# Altium schematic sheet ble.SchDoc
size A4
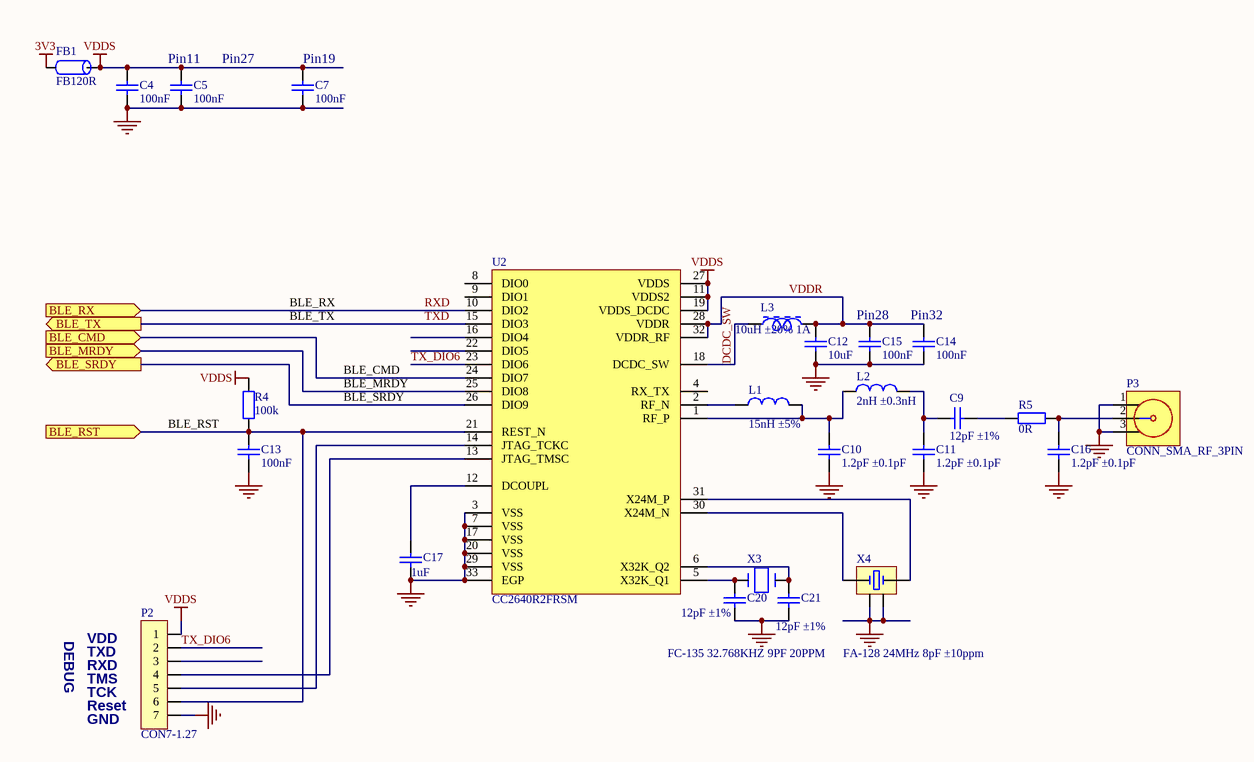
[diagram p0: ble.SchDoc]

## Parts
C4  100nF  [0402_C]
C5  100nF  [0402_C]
C7  100nF  [0402_C]
C9  12pF ±1%  [0402_C]
C10  1.2pF ±0.1pF  [0402_C]
C11  1.2pF ±0.1pF  [0402_C]
C12  10uF  [C0603]
C13  100nF  [0402_C]
C14  100nF  [0402_C]
C15  100nF  [0402_C]
C16  1.2pF ±0.1pF  [0402_C]
C17  1uF  [0402_C]
C20  12pF ±1%  [0402_C]
C21  12pF ±1%  [0402_C]
FB1  FB120R  [L0603]
L1  15nH ±5%  [LC-0402_L]
L2  2nH ±0.3nH  [LC-0402_L]
L3  10uH ±20% 1A  [L0805]
P2  CON7-1.27  [PH_7PIN_1.25_H-2]
P3  CONN_SMA_RF_3PIN  [PH_RF_2.5X2.5]
R4  100k  [0402_R]
R5  0R  [0402_R]
U2  CC2640R2FRSM  [VQFN-32_4x4x04P]
X3  FC-135 32.768KHZ 9PF 20PPM  [FC-135]
X4  FA-128 24MHz 8pF ±10ppm  [FA-128]

## Ports
BLE_CMD (in), BLE_MRDY (in), BLE_RST (in), BLE_RX (in), BLE_SRDY (out), BLE_TX (out)

## Nets
3V3: FB1.2
GND: C4.2 C5.2 C7.2 C10.1 C11.1 C12.1 C13.2 C14.2 C15.2 C16.1 C17.2 C20.1 C21.1 P2.7 P3.1 P3.3 U2.3(VSS) U2.7(VSS) U2.17(VSS) U2.20(VSS) U2.29(VSS) U2.33(EGP) X4.2 X4.4
VDDS: C4.1 C5.1 C7.1 FB1.1 P2.1 R4.2 U2.11(VDDS2) U2.19(VDDS_DCDC) U2.27(VDDS)
BLE_CMD: U2.24(DIO7) ; port BLE_CMD
BLE_MRDY: U2.25(DIO8) ; port BLE_MRDY
BLE_RST: C13.1 P2.6 R4.1 U2.21(REST_N) ; port BLE_RST
BLE_RX: U2.10(DIO2) ; port BLE_RX  [also labelled RXD]
BLE_SRDY: U2.26(DIO9) ; port BLE_SRDY
BLE_TX: U2.15(DIO3) ; port BLE_TX  [also labelled TXD]
DCDC_SW: L3.2 U2.18(DCDC_SW)
TX_DIO6: P2.2 U2.23(DIO6)
VDDR: C12.2 C14.1 C15.1 L3.1 U2.28(VDDR) U2.32(VDDR_RF)
NetC9_1: C9.1 R5.2
NetC9_2: C9.2 C11.2 L2.1
NetC10_2: C10.2 L1.1 L2.2 U2.1(RF_P)
NetC16_2: C16.2 P3.2 R5.1
NetC17_1: C17.1 U2.12(DCOUPL)
NetC20_2: C20.2 U2.5(X32K_Q1) X3.2
NetC21_2: C21.2 U2.6(X32K_Q2) X3.1
NetL1_2: L1.2 U2.2(RF_N)
NetP2_4: P2.4 U2.13(JTAG_TMSC)
NetP2_5: P2.5 U2.14(JTAG_TCKC)
NetU2_30: U2.30(X24M_N) X4.1
NetU2_31: U2.31(X24M_P) X4.3

Not connected (* = marked no-connect by the designer): P2 3; U2 4(RX_TX) 8(DIO0) 9(DIO1) 16(DIO4) 22(DIO5)

## Notes on the sheet
- (near C5) Pin11
- Pin27
- (near C7) Pin19
- (near C15) Pin28
- (near C14) Pin32
- (near P3) SMA
- DEBUG
- TMS
- TCK
- VDD
- TXD
- RXD
- GND
- (near P2) Reset

## Library data of the parts
C4 C5 C7 C13-C15 = Cap-0402_100n: 表贴电容0402,±10%,16V,X7R; Part Number: RP02.04.000221; LatestRevisionDate: 09-Feb-2017; LatestRevisionNote: SCHlib build; Publisher: ChenYinaho; PackageDescription: 0402C; Manufacturer: *; Manufacturer Part Number: *; Value: 100nF
C9 C20 C21 = Cap-0402_12p_mu_1%: 表贴陶瓷电容,0402,±1%,50V,C0G; Manufacturer: 村田; Manufacturer Part Number: GRM1555C1H120FA01D; Part Number: NEW; LatestRevisionDate: 09-Feb-2017; LatestRevisionNote: SCHlib build; Publisher: ChenYinaho; PackageDescription: C0402; Value: 12pF ±1%
C10 C11 C16 = Cap-0402_1.2p_mu: 表贴陶瓷电容,0402,±0.1pF,50V,C0G; Manufacturer: 村田; Manufacturer Part Number: GRM1555C1H1R2BA01D; Part Number: NEW; LatestRevisionDate: 09-Feb-2017; LatestRevisionNote: SCHlib build; Publisher: ChenYinaho; PackageDescription: C0402; Value: 1.2pF ±0.1pF
C12 = Cap-SMT-0603_10u: 表贴陶瓷电容,0603,±10%,10V; Manufacturer: YAGO; Part Number: RP02.04.000062; LatestRevisionDate: 09-Feb-2017; LatestRevisionNote: SCHlib build; Publisher: ChenYinaho; PackageDescription: C0603; Manufacturer Part Number: *; Value: 10uF
C17 = Cap-0402_1u: 表贴电容0402,±10%,6.3V; Part Number: RP02.04.000220; LatestRevisionDate: 09-Feb-2017; LatestRevisionNote: SCHlib build; Publisher: ChenYinaho; PackageDescription: 0402C; Manufacturer: *; Manufacturer Part Number: *; Value: 1uF
FB1 = FB_0603_120R: 贴片磁珠; Manufacturer: TDK; Part Number: RP02.99.000093; LatestRevisionDate: 09-Feb-2017; LatestRevisionNote: SCHlib build; Publisher: ChenYinaho; Manufacturer Part Number: *; Value: FB120R
L1 = Inductor_0402_15nH: 贴片电感 多层 0402 ±5% 450mA; Manufacturer: 村田; Manufacturer Part Number: LQG15HS15NJ02D; Part Number: NEW; LatestRevisionDate: 09-Feb-2017; LatestRevisionNote: SCHlib build; Publisher: ChenYinaho; Value: 15nH ±5%
L2 = Inductor_0402_2nH: 贴片电感 多层 0402 ±0.3nH 900mA; Manufacturer: 村田; Manufacturer Part Number: LQG15HS2N0S02D; Part Number: NEW; LatestRevisionDate: 09-Feb-2017; LatestRevisionNote: SCHlib build; Publisher: ChenYinaho; Value: 2nH ±0.3nH
L3 = Inductor_10uH_SL_0805: 贴片层叠电感; Manufacturer: Sunlord; Manufacturer Part Number: MPH201214S100MT; Part Number: NEW; LatestRevisionDate: 09-Feb-2017; LatestRevisionNote: SCHlib build; Publisher: ChenYinaho; Value: 10uH ±20% 1A
P2 = CON7: 直插插座; Part Number: RP02.07.000049; LatestRevisionDate: 09-Feb-2017; LatestRevisionNote: SCHlib build; Publisher: ChenYinaho; Manufacturer: *; Manufacturer Part Number: *; Value: CON7-1.27
P3 = CONN_SMA_RF_3PIN: 贴片天线座; Part Number: RP02.07.000078; LatestRevisionDate: 09-Feb-2017; LatestRevisionNote: SCHlib build; Publisher: ChenYinaho; Manufacturer: *; Manufacturer Part Number: *; Value: CONN_SMA_RF_3PIN
R4 = Res-0402_100k: 表贴电阻,0402,±1%,1/16W; Part Number: NEW; LatestRevisionDate: 09-Feb-2017; LatestRevisionNote: SCHlib build; Publisher: ChenYinaho; PackageDescription: 0402R; Manufacturer: *; Manufacturer Part Number: *; Value: 100k
R5 = Res-0402_0R: 表贴电阻,0402,±1%,1/16W; Part Number: NEW; LatestRevisionDate: 09-Feb-2017; LatestRevisionNote: SCHlib build; Publisher: ChenYinaho; PackageDescription: 0402R; Manufacturer: *; Manufacturer Part Number: *; Value: 0R
U2 = CC2640R2FRSM: 无线收发芯片; Manufacturer: TI; Part Number: NEW; LatestRevisionDate: 09-Feb-2017; LatestRevisionNote: SCHlib build; Publisher: ChenYinaho; Manufacturer Part Number: CC2640R2FRSM; Value: CC2640R2FRSM; PackageDescription: VQFN-32_4x4x04P
X3 = XTAL-3215_2P_32k_9pF: 贴片无源晶体3215; Manufacturer: EPSON(爱普生); Part Number: NEW; LatestRevisionDate: 09-Feb-2017; LatestRevisionNote: SCHlib build; Publisher: ChenYinaho; Manufacturer Part Number: FC-13532.768KHZ9PF20PPM; Value: FC-135 32.768KHZ 9PF 20PPM
X4 = XTAL-2016_4P_24M_8pF: 贴片无源晶体2016; Manufacturer: EPSON(爱普生); Manufacturer Part Number: Q22FA12800120; Part Number: NEW; LatestRevisionDate: 09-Feb-2017; LatestRevisionNote: SCHlib build; Publisher: ChenYinaho; Value: FA-128 24MHz 8pF ±10ppm